# Altium schematic sheet POWER.SchDoc
size A4
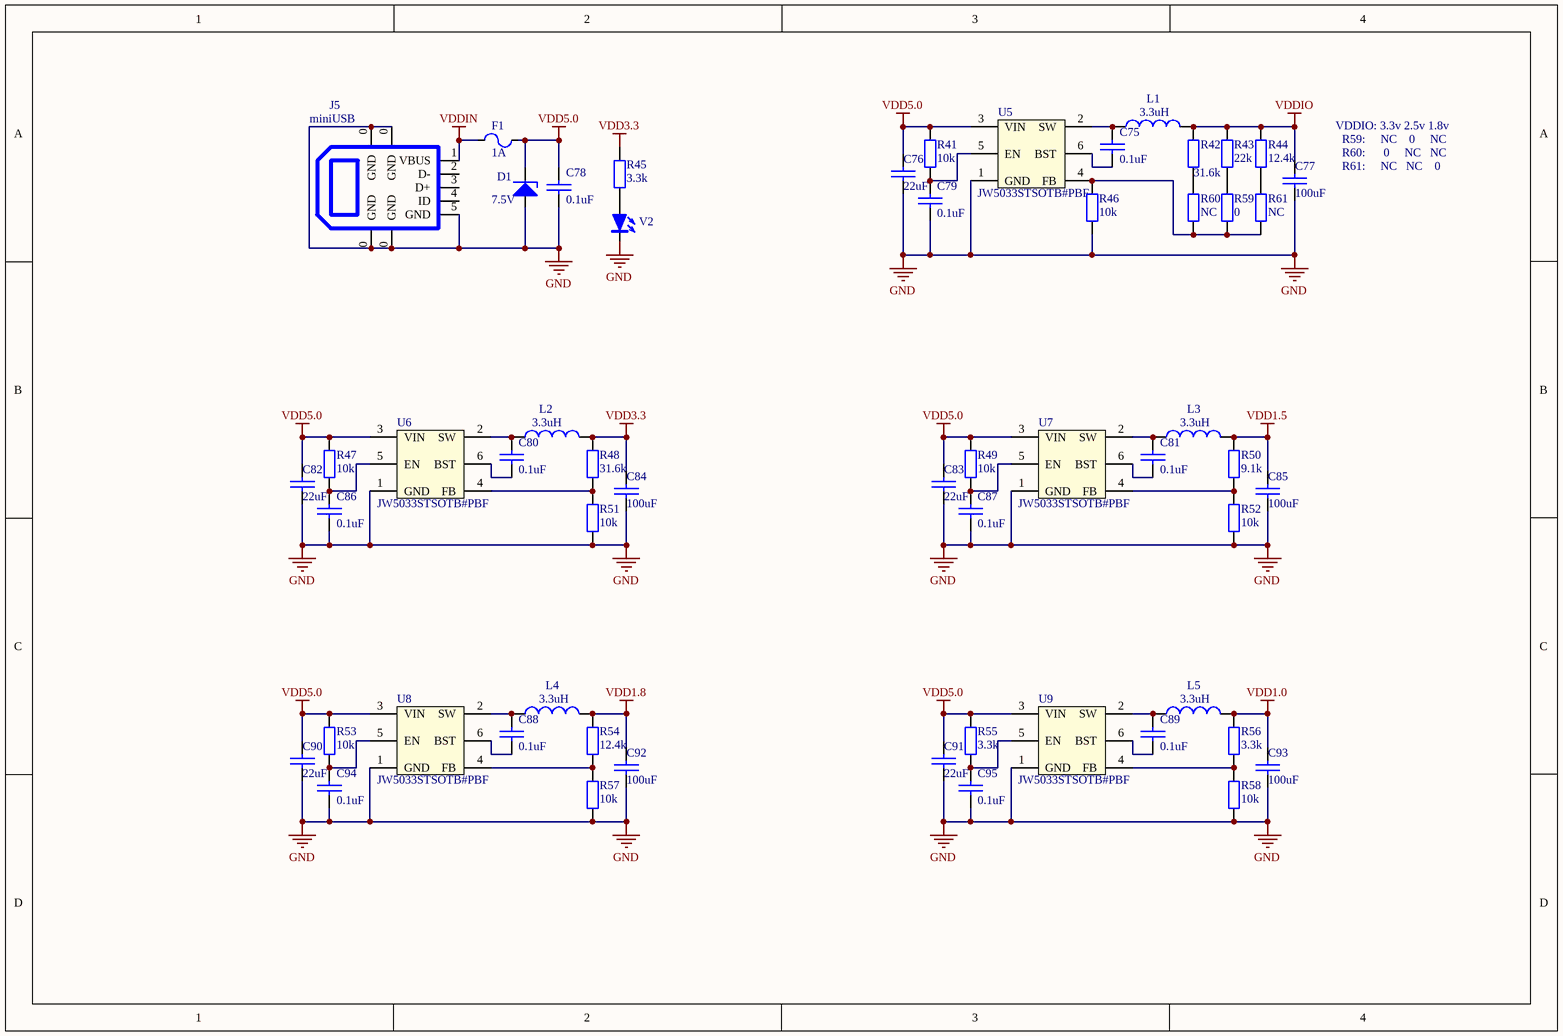
[diagram p0: POWER.SchDoc]

## Parts
C75  0.1uF  [0402_C_M]
C76  22uF  [1210_C_M]
C77  100uF  [1210_C_M]
C78  0.1uF  [0603_C_M]
C79  0.1uF  [0402_C_M]
C80  0.1uF  [0402_C_M]
C81  0.1uF  [0402_C_M]
C82  22uF  [1210_C_M]
C83  22uF  [1210_C_M]
C84  100uF  [1210_C_M]
C85  100uF  [1210_C_M]
C86  0.1uF  [0402_C_M]
C87  0.1uF  [0402_C_M]
C88  0.1uF  [0402_C_M]
C89  0.1uF  [0402_C_M]
C90  22uF  [1210_C_M]
C91  22uF  [1210_C_M]
C92  100uF  [1210_C_M]
C93  100uF  [1210_C_M]
C94  0.1uF  [0402_C_M]
C95  0.1uF  [0402_C_M]
D1  7.5V  [1206D]
F1  1A  [1812F]
J5  miniUSB  [miniUSB]
L1  3.3uH  [CD42]
L2  3.3uH  [CD42]
L3  3.3uH  [CD42]
L4  3.3uH  [CD42]
L5  3.3uH  [CD42]
R41  10k  [0402_R_M]
R42  31.6k  [0402_R_M]
R43  22k  [0402_R_M]
R44  12.4k  [0402_R_M]
R45  3.3k  [0402_R_M]
R46  10k  [0402_R_M]
R47  10k  [0402_R_M]
R48  31.6k  [0402_R_M]
R49  10k  [0402_R_M]
R50  9.1k  [0402_R_M]
R51  10k  [0402_R_M]
R52  10k  [0402_R_M]
R53  10k  [0402_R_M]
R54  12.4k  [0402_R_M]
R55  3.3k  [0402_R_M]
R56  3.3k  [0402_R_M]
R57  10k  [0402_R_M]
R58  10k  [0402_R_M]
R59  0  [0402_R_M]
R60  NC  [0402_R_M]
R61  NC  [0402_R_M]
U5  JW5033STSOTB#PBF  [SOT23-6]
U6  JW5033STSOTB#PBF  [SOT23-6]
U7  JW5033STSOTB#PBF  [SOT23-6]
U8  JW5033STSOTB#PBF  [SOT23-6]
U9  JW5033STSOTB#PBF  [SOT23-6]
V2  LED  [0805D]  (value not drawn)

## Nets
GND: C76.2 C77.2 C78.2 C79.2 C82.2 C83.2 C84.2 C85.2 C86.2 C87.2 C90.2 C91.2 C92.2 C93.2 C94.2 C95.2 D1.1 J5.0(GND) J5.5(GND) R46.2 R51.2 R52.2 R57.2 R58.2 U5.1(GND) U6.1(GND) U7.1(GND) U8.1(GND) U9.1(GND) V2.2
VDD1.0: C93.1 L5.2 R56.2
VDD1.5: C85.1 L3.2 R50.2
VDD1.8: C92.1 L4.2 R54.2
VDD3.3: C84.1 L2.2 R45.2 R48.2
VDD5.0: C76.1 C78.1 C82.1 C83.1 C90.1 C91.1 D1.2 F1.2 R41.2 R47.2 R49.2 R53.2 R55.2 U5.3(VIN) U6.3(VIN) U7.3(VIN) U8.3(VIN) U9.3(VIN)
VDDIN: F1.1 J5.1(VBUS)
VDDIO: C77.1 L1.2 R42.2 R43.2 R44.2
NetC75_1: C75.1 L1.1 U5.2(SW)
NetC75_2: C75.2 U5.6(BST)
NetC79_1: C79.1 R41.1 U5.5(EN)
NetC80_1: C80.1 U6.6(BST)
NetC80_2: C80.2 L2.1 U6.2(SW)
NetC81_1: C81.1 U7.6(BST)
NetC81_2: C81.2 L3.1 U7.2(SW)
NetC86_1: C86.1 R47.1 U6.5(EN)
NetC87_1: C87.1 R49.1 U7.5(EN)
NetC88_1: C88.1 U8.6(BST)
NetC88_2: C88.2 L4.1 U8.2(SW)
NetC89_1: C89.1 U9.6(BST)
NetC89_2: C89.2 L5.1 U9.2(SW)
NetC94_1: C94.1 R53.1 U8.5(EN)
NetC95_1: C95.1 R55.1 U9.5(EN)
NetR42_1: R42.1 R60.2
NetR43_1: R43.1 R59.2
NetR44_1: R44.1 R61.2
NetR45_1: R45.1 V2.1
NetR46_1: R46.1 R59.1 R60.1 R61.1 U5.4(FB)
NetR48_1: R48.1 R51.1 U6.4(FB)
NetR50_1: R50.1 R52.1 U7.4(FB)
NetR54_1: R54.1 R57.1 U8.4(FB)
NetR56_1: R56.1 R58.1 U9.4(FB)

Not connected (* = marked no-connect by the designer): J5 2(D-) 3(D+) 4(ID)

## Notes on the sheet
- VDDIO: 3.3v 2.5v 1.8v
- R59:     NC    0     NC
- (near C77) R60:      0     NC   NC
- (near C77) R61:     NC   NC    0

## Library data of the parts
C75-C95 = CAP
D1 = D4
F1 = FUSE1
L1-L5 = INDUCTOR1
R41-R61 = RES2
U5-U9 = JW5060TTSOTB#PBF
V2 = LED2